# Altium schematic sheet eMIC-CE14.SchDoc
size A
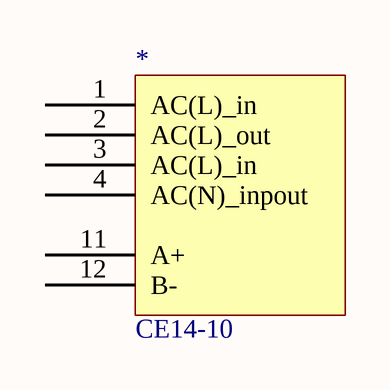
[diagram p0: eMIC-CE14.SchDoc]

## Parts
*  CE14-10

## Nets

Not connected (* = marked no-connect by the designer): * 1(AC(L)_in) 2(AC(L)_out) 3(AC(L)_in) 4(AC(N)_inpout) 11(A+) 12(B-)